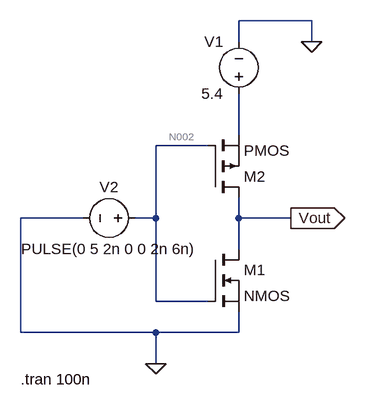
[diagram p0: schematic invertor_cmos.asc]
invertor_cmos.asc, the LTspice schematic file:
Version 4.1
SHEET 1 880 680
WIRE 288 -144 176 -144
WIRE 176 -112 176 -144
WIRE 288 -112 288 -144
WIRE 176 32 176 -32
WIRE 128 48 48 48
WIRE -64 160 -160 160
WIRE 48 160 48 48
WIRE 48 160 16 160
WIRE 176 160 176 128
WIRE 256 160 176 160
WIRE 176 208 176 160
WIRE 48 288 48 160
WIRE 128 288 48 288
WIRE -160 336 -160 160
WIRE 48 336 -160 336
WIRE 176 336 176 304
WIRE 176 336 48 336
WIRE 48 384 48 336
FLAG 48 384 0
FLAG 288 -112 0
FLAG 256 160 Vout
IOPIN 256 160 Out
SYMBOL nmos 128 208 R0
SYMATTR InstName M1
SYMBOL pmos 128 128 M180
SYMATTR InstName M2
SYMBOL voltage 176 -16 R180
WINDOW 0 24 96 Left 2
WINDOW 3 24 16 Left 2
WINDOW 123 0 0 Left 0
WINDOW 39 0 0 Left 0
SYMATTR InstName V1
SYMATTR Value 5.4
SYMBOL voltage 32 160 R90
WINDOW 0 -32 56 VBottom 2
WINDOW 3 32 56 VTop 2
WINDOW 123 0 0 Left 0
WINDOW 39 0 0 Left 0
SYMATTR InstName V2
SYMATTR Value PULSE(0 5 2n 0 0 2n 6n)
TEXT -160 408 Left 2 !.tran 100n

The netlist it stands for:
* invertor_cmos.asc
M1 Vout N002 0 0 NMOS
M2 Vout N002 N001 N001 PMOS
V1 N001 0 5.4
V2 N002 0 PULSE(0 5 2n 0 0 2n 6n)
.model NMOS NMOS
.model PMOS PMOS
.lib standard.mos
.tran 100n
.backanno
.end

* Results of the author's LTspice run, read from the files saved beside the schematic
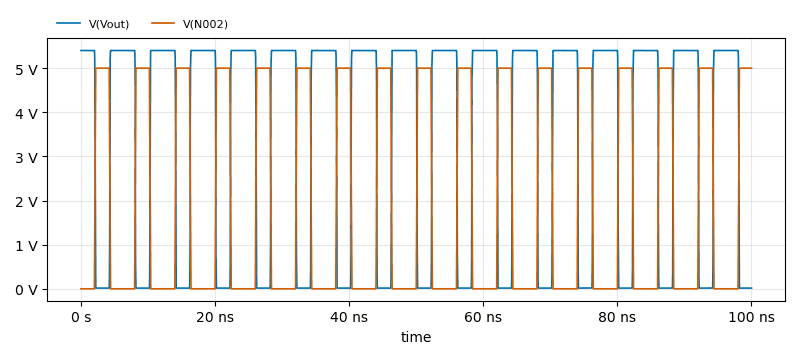
[diagram p1: Transient Analysis of invertor_cmos.asc, plotted from the saved traces]
* Transient Analysis, 1 run:
*   V(Vout): min 16.01 mV, max 5.403 V, average 3.417 V, rms 4.276 V, last 16.03 mV
*   V(N002): min 0 V, max 5 V, average 1.855 V, rms 3.004 V, last 5 V